# EAGLE schematic BeeBeeAte-BotBoard (EAGLE 9.6.2)

## Sheet 1 of 4: Power Supply
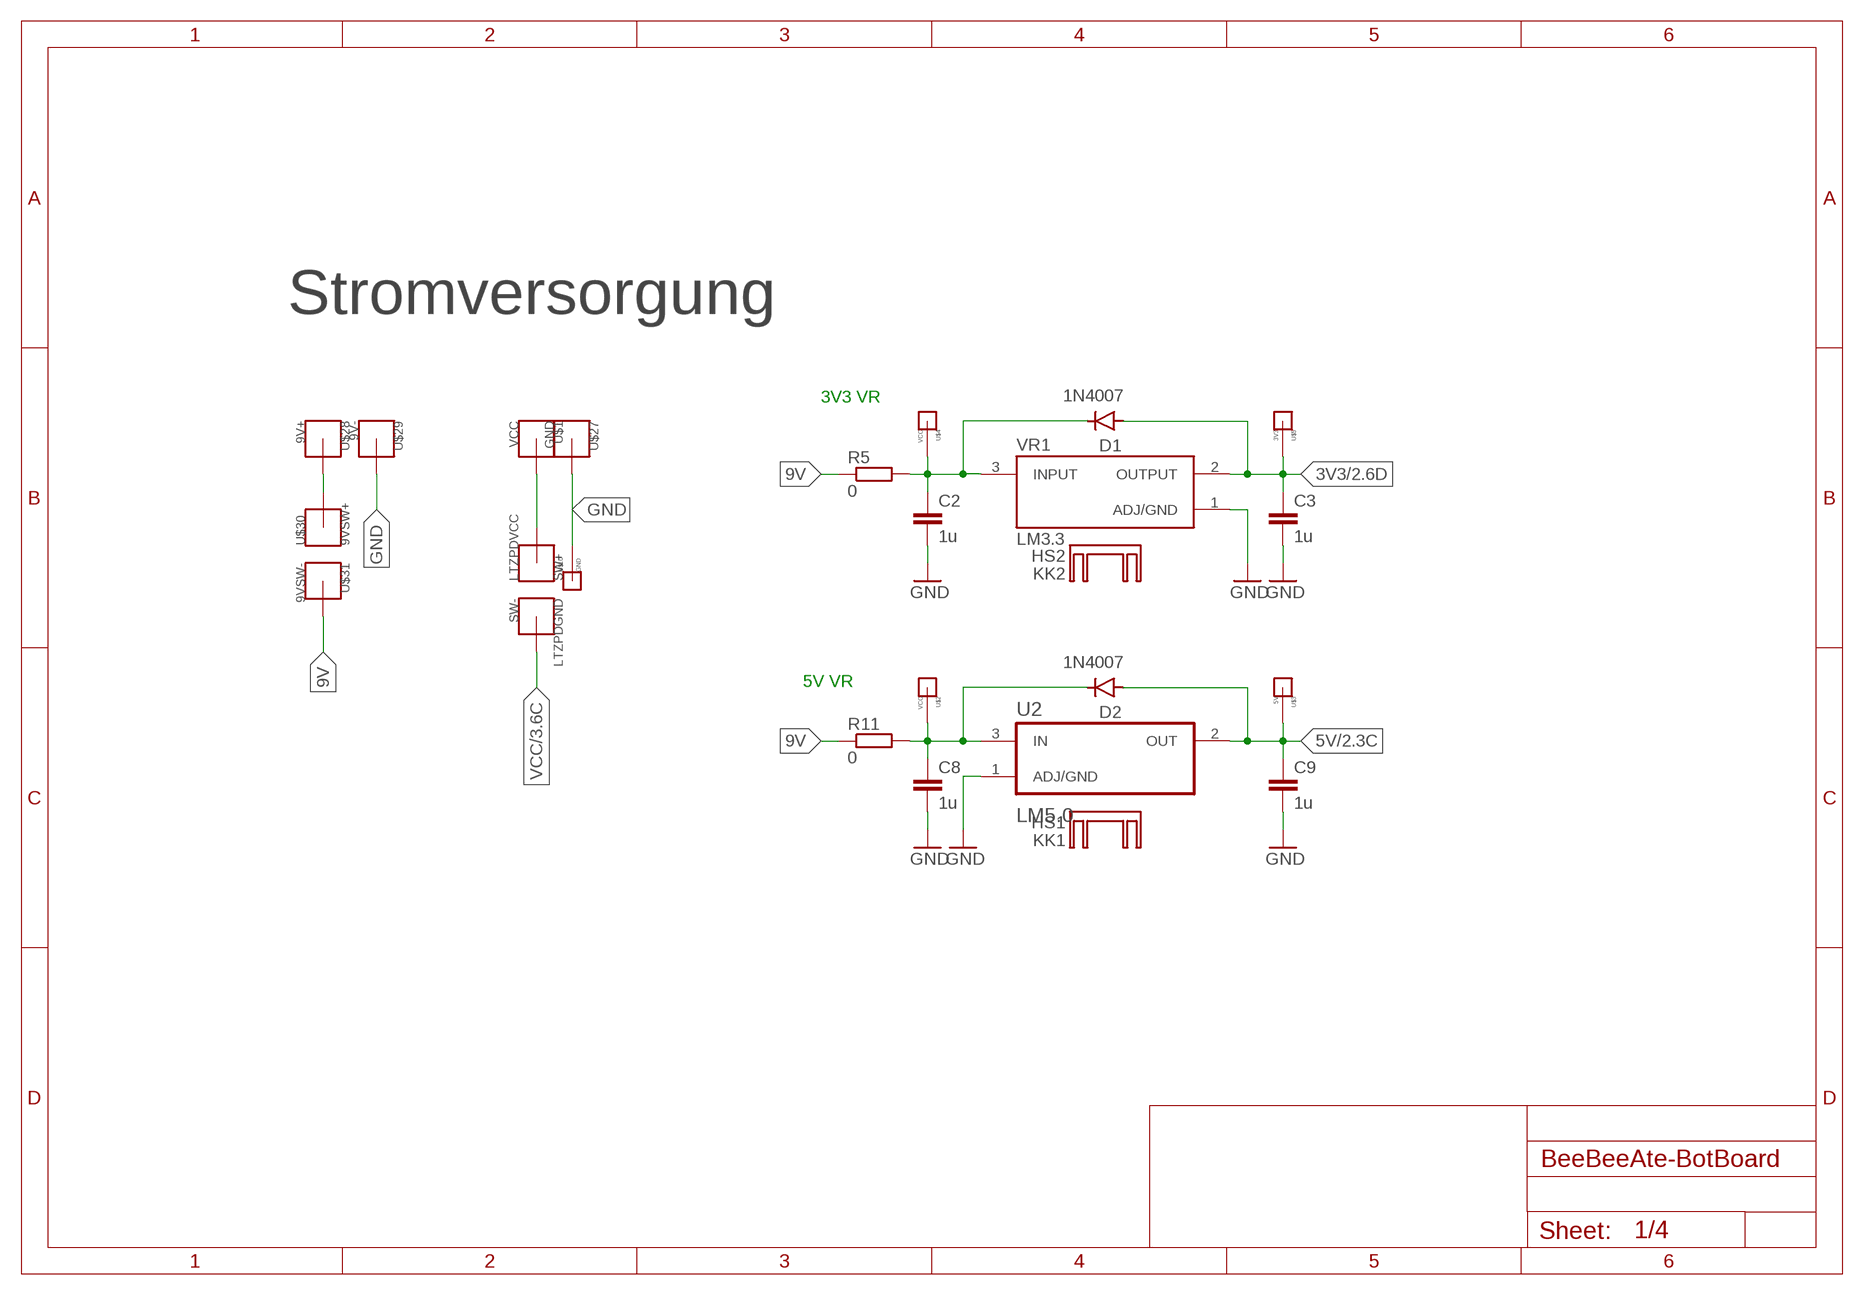
[diagram p0: schematic, sheet 1]

### Parts
C2  1u  C-EUC0805  [C0805]
C3  1u  C-EUC0805  [C0805]
C8  1u  C-EUC0805  [C0805]
C9  1u  C-EUC0805  [C0805]
D1  1N4007  [DO-41]
D2  1N4007  [DO-41]
KK1  HS1  SK95-2M3  [SK95-2M3]
KK2  HS2  SK95-2M3  [SK95-2M3]
LTZPDGND  SW-  LITZENPAD  [LITZENPAD]
LTZPDVCC  SW+  LITZENPAD  [LITZENPAD]
R5  0  R-EU_R0805  [R0805]
R11  0  R-EU_R0805  [R0805]
U2  LM5.0  LM1117T-5.0  [TO254P1054X470X1955-3]
U$1  VCC  LITZENPAD  [LITZENPAD]
U$2  VCC  MESSPAD  [MESSPAD]
U$3  5V  MESSPAD  [MESSPAD]
U$4  VCC  MESSPAD  [MESSPAD]
U$5  3V3  MESSPAD  [MESSPAD]
U$10  GND  MESSPAD  [MESSPAD]
U$27  GND  LITZENPAD  [LITZENPAD]
U$28  9V+  LITZENPAD  [LITZENPAD]
U$29  9V-  LITZENPAD  [LITZENPAD]
U$30  9VSW+  LITZENPAD  [LITZENPAD]
U$31  9VSW-  LITZENPAD  [LITZENPAD]
VR1  LM3.3  LM1117T-3.3/NOPB  [TO254P1054X470X1955-3]

### Nets
3V3: C3.1 D1.A U$5.MSP VR1.2(OUTPUT) ; also sheet 2,3,4
5V: C9.1 D2.A U2.2(OUT) U$3.MSP ; also sheet 2
9V: R5.1 R11.1 U$31.P$1
GND: C2.2 C3.2 C8.2 C9.2 U2.1(ADJ/GND) U$10.MSP U$27.P$1 U$29.P$1 VR1.1(ADJ/GND) ; also sheet 2,3,4
N$4: C2.1 D1.C R5.2 U$4.MSP VR1.3(INPUT)
N$5: LTZPDVCC.P$1 U$1.P$1
N$8: C8.1 D2.C R11.2 U2.3(IN) U$2.MSP
N$15: U$28.P$1 U$30.P$1
VCC: LTZPDGND.P$1 ; also sheet 3

### Notes on the sheet
- Stromversorgung
- 3V3 VR
- 5V VR

## Sheet 2 of 4: ESP32 und USB Modul
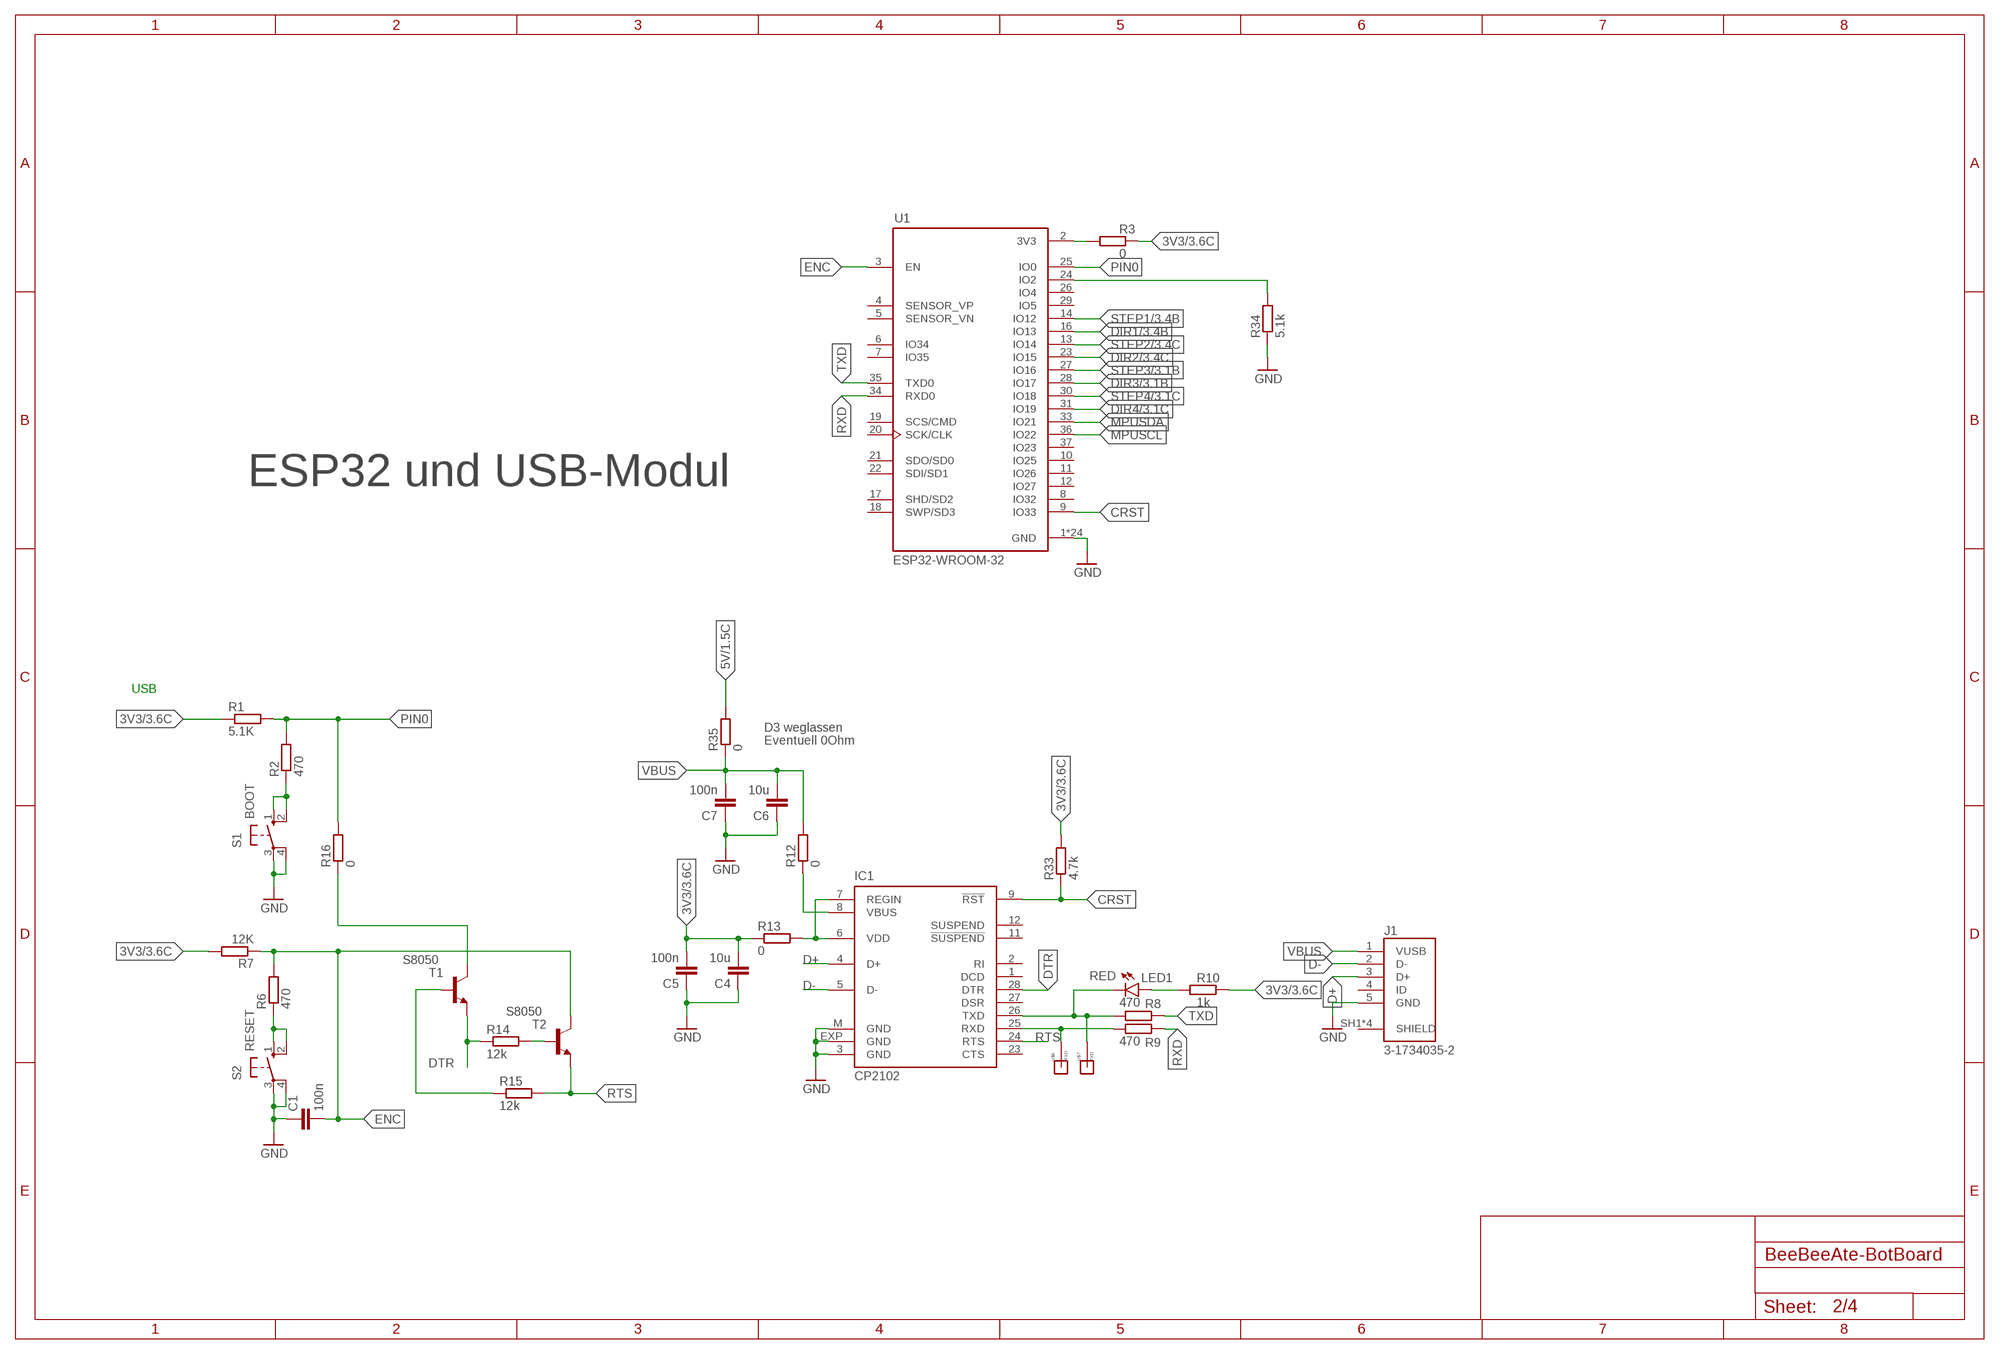
[diagram p1: schematic, sheet 2]

### Parts
C1  100n  C-EUC0805  [C0805]
C4  10u  C-EUC0805  [C0805]
C5  100n  C-EUC0805  [C0805]
C6  10u  C-EUC0805  [C0805]
C7  100n  C-EUC0805  [C0805]
IC1  CP2102  [MLP28]
J1  3-1734035-2  [TE_3-1734035-2]
LED1  RED  LEDCHIP-LED0805  [CHIP-LED0805]
R1  5.1K  R-EU_R0805  [R0805]
R2  470  R-EU_R0805  [R0805]
R3  0  R-EU_R0805  [R0805]
R6  470  R-EU_R0805  [R0805]
R7  12K  R-EU_R0805  [R0805]
R8  470  R-EU_R0805  [R0805]
R9  470  R-EU_R0805  [R0805]
R10  1k  R-EU_R0805  [R0805]
R12  0  R-EU_R0805  [R0805]
R13  0  R-EU_R0805  [R0805]
R14  12k  R-EU_R0805  [R0805]
R15  12k  R-EU_R0805  [R0805]
R16  0  R-EU_R0805  [R0805]
R33  4.7k  R-EU_R0805  [R0805]
R34  5.1k  R-EU_R0805  [R0805]
R35  0  R-EU_R0805  [R0805]
S1  BOOT  10-XX  [B3F-10XX]
S2  RESET  10-XX  [B3F-10XX]
T1  S8050  BC808-NPN-SOT23-BEC  [SOT23-BEC]
T2  S8050  BC808-NPN-SOT23-BEC  [SOT23-BEC]
U1  ESP32-WROOM-32  [MODULE_ESP32-WROOM-32]
U$6  RXD  MESSPAD  [MESSPAD]
U$7  TXD  MESSPAD  [MESSPAD]

### Nets
3V3: C4.2 C5.2 R1.1 R3.2 R7.2 R10.2 R13.1 R33.2 ; also sheet 1,3,4
5V: R35.2 ; also sheet 1
CRST: IC1.9(!RST) R33.1 U1.9(IO33)
D+: IC1.4(D+) J1.3(D+)
D-: IC1.5(D-) J1.2(D-)
DIR1: U1.16(IO13) ; also sheet 3
DIR2: U1.23(IO15) ; also sheet 3
DIR3: U1.28(IO17) ; also sheet 3
DIR4: U1.31(IO19) ; also sheet 3
DTR: IC1.28(DTR) R14.1 T1.E
ENC: C1.2 R6.2 R7.1 T2.C U1.3(EN)
GND: C1.1 C4.1 C5.1 C6.1 C7.1 IC1.3(GND) IC1.EXP(GND) IC1.M(GND) J1.5(GND) R34.1 S1.3(P) S1.4(P1) S2.3(P) S2.4(P1) U1.1(GND) U1.15(GND) U1.38(GND) U1.39_1(GND) U1.39_2(GND) U1.39_3(GND) U1.39_4(GND) U1.39_5(GND) U1.39_6(GND) U1.39_7(GND) U1.39_8(GND) U1.39_9(GND) U1.39_10(GND) U1.39_11(GND) U1.39_12(GND) U1.39_13(GND) U1.39_14(GND) U1.39_15(GND) U1.39_16(GND) U1.39_17(GND) U1.39_18(GND) U1.39_19(GND) U1.39_20(GND) U1.39_21(GND) ; also sheet 1,3,4
MPUSCL: U1.36(IO22) ; also sheet 4
MPUSDA: U1.33(IO21) ; also sheet 4
N$1: R2.1 S1.1(S) S1.2(S1)
N$2: R6.1 S2.1(S) S2.2(S1)
N$6: IC1.25(RXD) R9.1 U$6.MSP
N$7: LED1.A R10.1
N$9: IC1.26(TXD) LED1.C R8.1 U$7.MSP
N$10: IC1.6(VDD) IC1.7(REGIN) R13.2
N$11: IC1.8(VBUS) R12.1
N$12: R14.2 T2.B
N$14: R15.1 T1.B
N$25: R34.2 U1.24(IO2)
N$30: R3.1 U1.2(3V3)
PIN0: R1.2 R2.2 R16.2 U1.25(IO0)
PIN1: R16.1 T1.C
RTS: IC1.24(RTS) R15.2 T2.E
RXD: R9.2 U1.34(RXD0)
STEP1: U1.14(IO12) ; also sheet 3
STEP2: U1.13(IO14) ; also sheet 3
STEP3: U1.27(IO16) ; also sheet 3
STEP4: U1.30(IO18) ; also sheet 3
TXD: R8.2 U1.35(TXD0)
VBUS: C6.2 C7.2 J1.1(VUSB) R12.2 R35.1
Unconnected: IC1.1(DCD) IC1.2(RI) IC1.11(!SUSPEND) IC1.12(SUSPEND) IC1.23(CTS) IC1.27(DSR) J1.4(ID) J1.SH1(SHIELD) J1.SH2(SHIELD) J1.SH3(SHIELD) J1.SH4(SHIELD) U1.4(SENSOR_VP) U1.5(SENSOR_VN) U1.6(IO34) U1.7(IO35) U1.8(IO32) U1.10(IO25) U1.11(IO26) U1.12(IO27) U1.17(SHD/SD2) U1.18(SWP/SD3) U1.19(SCS/CMD) U1.20(SCK/CLK) U1.21(SDO/SD0) U1.22(SDI/SD1) U1.26(IO4) U1.29(IO5) U1.37(IO23)

### Notes on the sheet
- ESP32 und USB-Modul
- USB
- D3 weglassen
- Eventuell 0Ohm

## Sheet 3 of 4: Treiber für Motoren
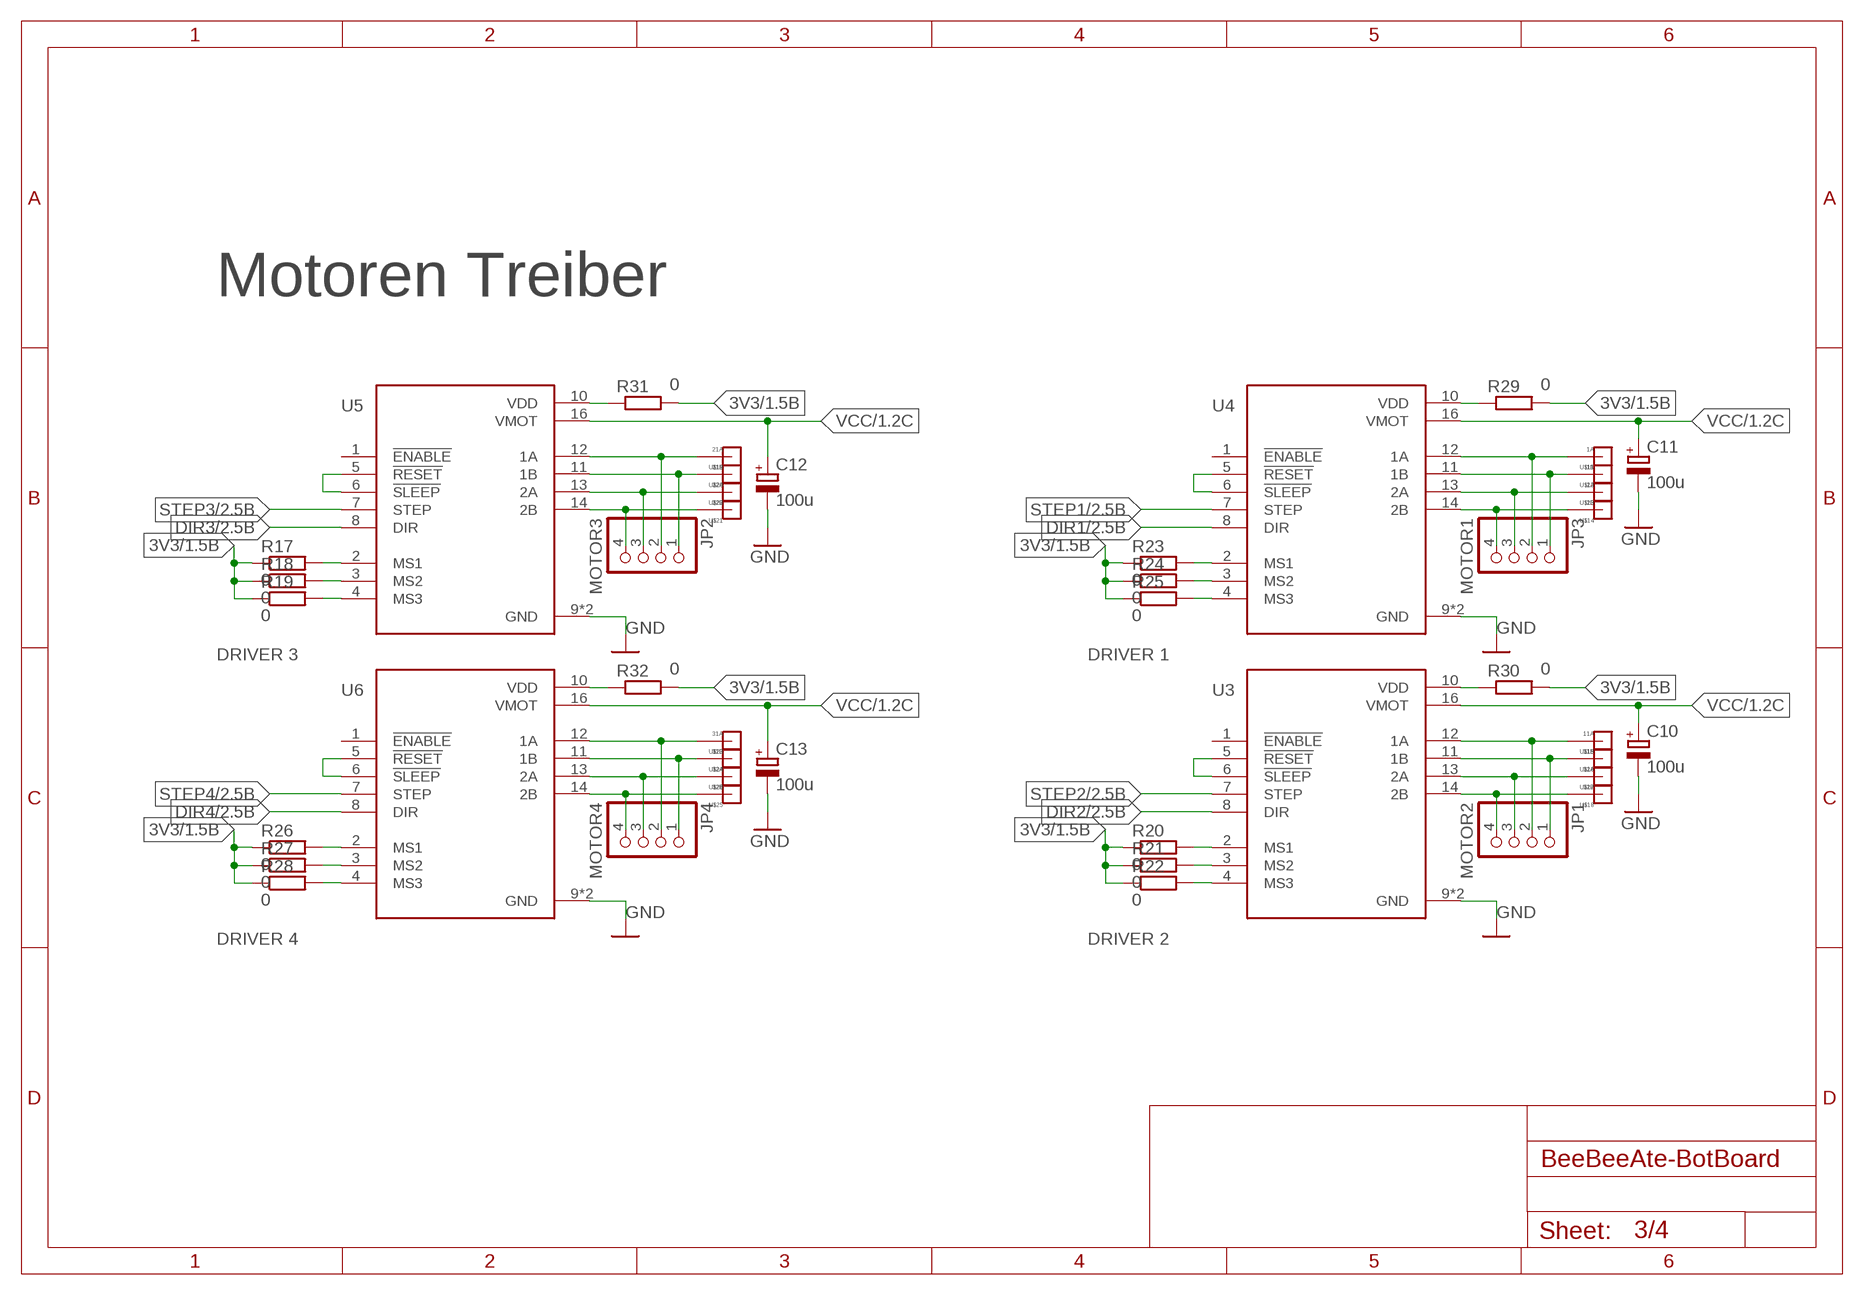
[diagram p2: schematic, sheet 3]

### Parts
C10  100u  CPOL-EU153CLV-0605  [153CLV-0605]
C11  100u  CPOL-EU153CLV-0605  [153CLV-0605]
C12  100u  CPOL-EU153CLV-0605  [153CLV-0605]
C13  100u  CPOL-EU153CLV-0605  [153CLV-0605]
JP1  MOTOR2  PINHD-1X4  [1X04]
JP2  MOTOR3  PINHD-1X4  [1X04]
JP3  MOTOR1  PINHD-1X4  [1X04]
JP4  MOTOR4  PINHD-1X4  [1X04]
R17  0  R-EU_R0805  [R0805]
R18  0  R-EU_R0805  [R0805]
R19  0  R-EU_R0805  [R0805]
R20  0  R-EU_R0805  [R0805]
R21  0  R-EU_R0805  [R0805]
R22  0  R-EU_R0805  [R0805]
R23  0  R-EU_R0805  [R0805]
R24  0  R-EU_R0805  [R0805]
R25  0  R-EU_R0805  [R0805]
R26  0  R-EU_R0805  [R0805]
R27  0  R-EU_R0805  [R0805]
R28  0  R-EU_R0805  [R0805]
R29  0  R-EU_R0805  [R0805]
R30  0  R-EU_R0805  [R0805]
R31  0  R-EU_R0805  [R0805]
R32  0  R-EU_R0805  [R0805]
U3  DRIVER 2  A4988_STEPPER_MOTOR_DRIVER_CARRIER  [MODULE_A4988_STEPPER_MOTOR_DRIVER_CARRIER]
U4  DRIVER 1  A4988_STEPPER_MOTOR_DRIVER_CARRIER  [MODULE_A4988_STEPPER_MOTOR_DRIVER_CARRIER]
U5  DRIVER 3  A4988_STEPPER_MOTOR_DRIVER_CARRIER  [MODULE_A4988_STEPPER_MOTOR_DRIVER_CARRIER]
U6  DRIVER 4  A4988_STEPPER_MOTOR_DRIVER_CARRIER  [MODULE_A4988_STEPPER_MOTOR_DRIVER_CARRIER]
U$11  1A  MESSPAD  [MESSPAD]
U$12  1B  MESSPAD  [MESSPAD]
U$13  2A  MESSPAD  [MESSPAD]
U$14  2B  MESSPAD  [MESSPAD]
U$15  11A  MESSPAD  [MESSPAD]
U$16  11B  MESSPAD  [MESSPAD]
U$17  12A  MESSPAD  [MESSPAD]
U$18  12B  MESSPAD  [MESSPAD]
U$19  21A  MESSPAD  [MESSPAD]
U$20  21B  MESSPAD  [MESSPAD]
U$21  22B  MESSPAD  [MESSPAD]
U$22  22A  MESSPAD  [MESSPAD]
U$23  31A  MESSPAD  [MESSPAD]
U$24  31B  MESSPAD  [MESSPAD]
U$25  32B  MESSPAD  [MESSPAD]
U$26  32A  MESSPAD  [MESSPAD]

### Nets
3V3: R17.1 R18.1 R19.1 R20.1 R21.1 R22.1 R23.1 R24.1 R25.1 R26.1 R27.1 R28.1 R29.2 R30.2 R31.2 R32.2 ; also sheet 1,2,4
DIR1: U4.8(DIR) ; also sheet 2
DIR2: U3.8(DIR) ; also sheet 2
DIR3: U5.8(DIR) ; also sheet 2
DIR4: U6.8(DIR) ; also sheet 2
GND: C10.- C11.- C12.- C13.- U3.9(GND) U3.15(GND) U4.9(GND) U4.15(GND) U5.9(GND) U5.15(GND) U6.9(GND) U6.15(GND) ; also sheet 1,2,4
N$13: R30.1 U3.10(VDD)
N$16: JP1.2 U3.12(1A) U$15.MSP
N$17: JP1.1 U3.11(1B) U$16.MSP
N$18: JP1.3 U3.13(2A) U$17.MSP
N$19: JP1.4 U3.14(2B) U$18.MSP
N$20: R20.2 U3.2(MS1)
N$21: R21.2 U3.3(MS2)
N$22: R22.2 U3.4(MS3)
N$23: U3.5(!RESET) U3.6(!SLEEP)
N$24: R29.1 U4.10(VDD)
N$26: JP2.2 U5.12(1A) U$19.MSP
N$27: JP2.1 U5.11(1B) U$20.MSP
N$28: JP2.3 U5.13(2A) U$22.MSP
N$29: JP2.4 U5.14(2B) U$21.MSP
N$32: JP3.2 U4.12(1A) U$11.MSP
N$33: JP3.1 U4.11(1B) U$12.MSP
N$34: JP3.3 U4.13(2A) U$13.MSP
N$35: R17.2 U5.2(MS1)
N$36: R18.2 U5.3(MS2)
N$37: R19.2 U5.4(MS3)
N$38: U5.5(!RESET) U5.6(!SLEEP)
N$39: R31.1 U5.10(VDD)
N$40: R32.1 U6.10(VDD)
N$41: JP3.4 U4.14(2B) U$14.MSP
N$42: R23.2 U4.2(MS1)
N$43: R24.2 U4.3(MS2)
N$44: R25.2 U4.4(MS3)
N$45: U4.5(!RESET) U4.6(!SLEEP)
N$49: JP4.2 U6.12(1A) U$23.MSP
N$50: JP4.1 U6.11(1B) U$24.MSP
N$51: JP4.3 U6.13(2A) U$26.MSP
N$52: JP4.4 U6.14(2B) U$25.MSP
N$53: R26.2 U6.2(MS1)
N$54: R27.2 U6.3(MS2)
N$55: R28.2 U6.4(MS3)
N$56: U6.5(!RESET) U6.6(!SLEEP)
STEP1: U4.7(STEP) ; also sheet 2
STEP2: U3.7(STEP) ; also sheet 2
STEP3: U5.7(STEP) ; also sheet 2
STEP4: U6.7(STEP) ; also sheet 2
VCC: C10.+ C11.+ C12.+ C13.+ U3.16(VMOT) U4.16(VMOT) U5.16(VMOT) U6.16(VMOT) ; also sheet 1
Unconnected: U3.1(!ENABLE) U4.1(!ENABLE) U5.1(!ENABLE) U6.1(!ENABLE)

### Notes on the sheet
- Motoren Treiber

## Sheet 4 of 4: MPU6050
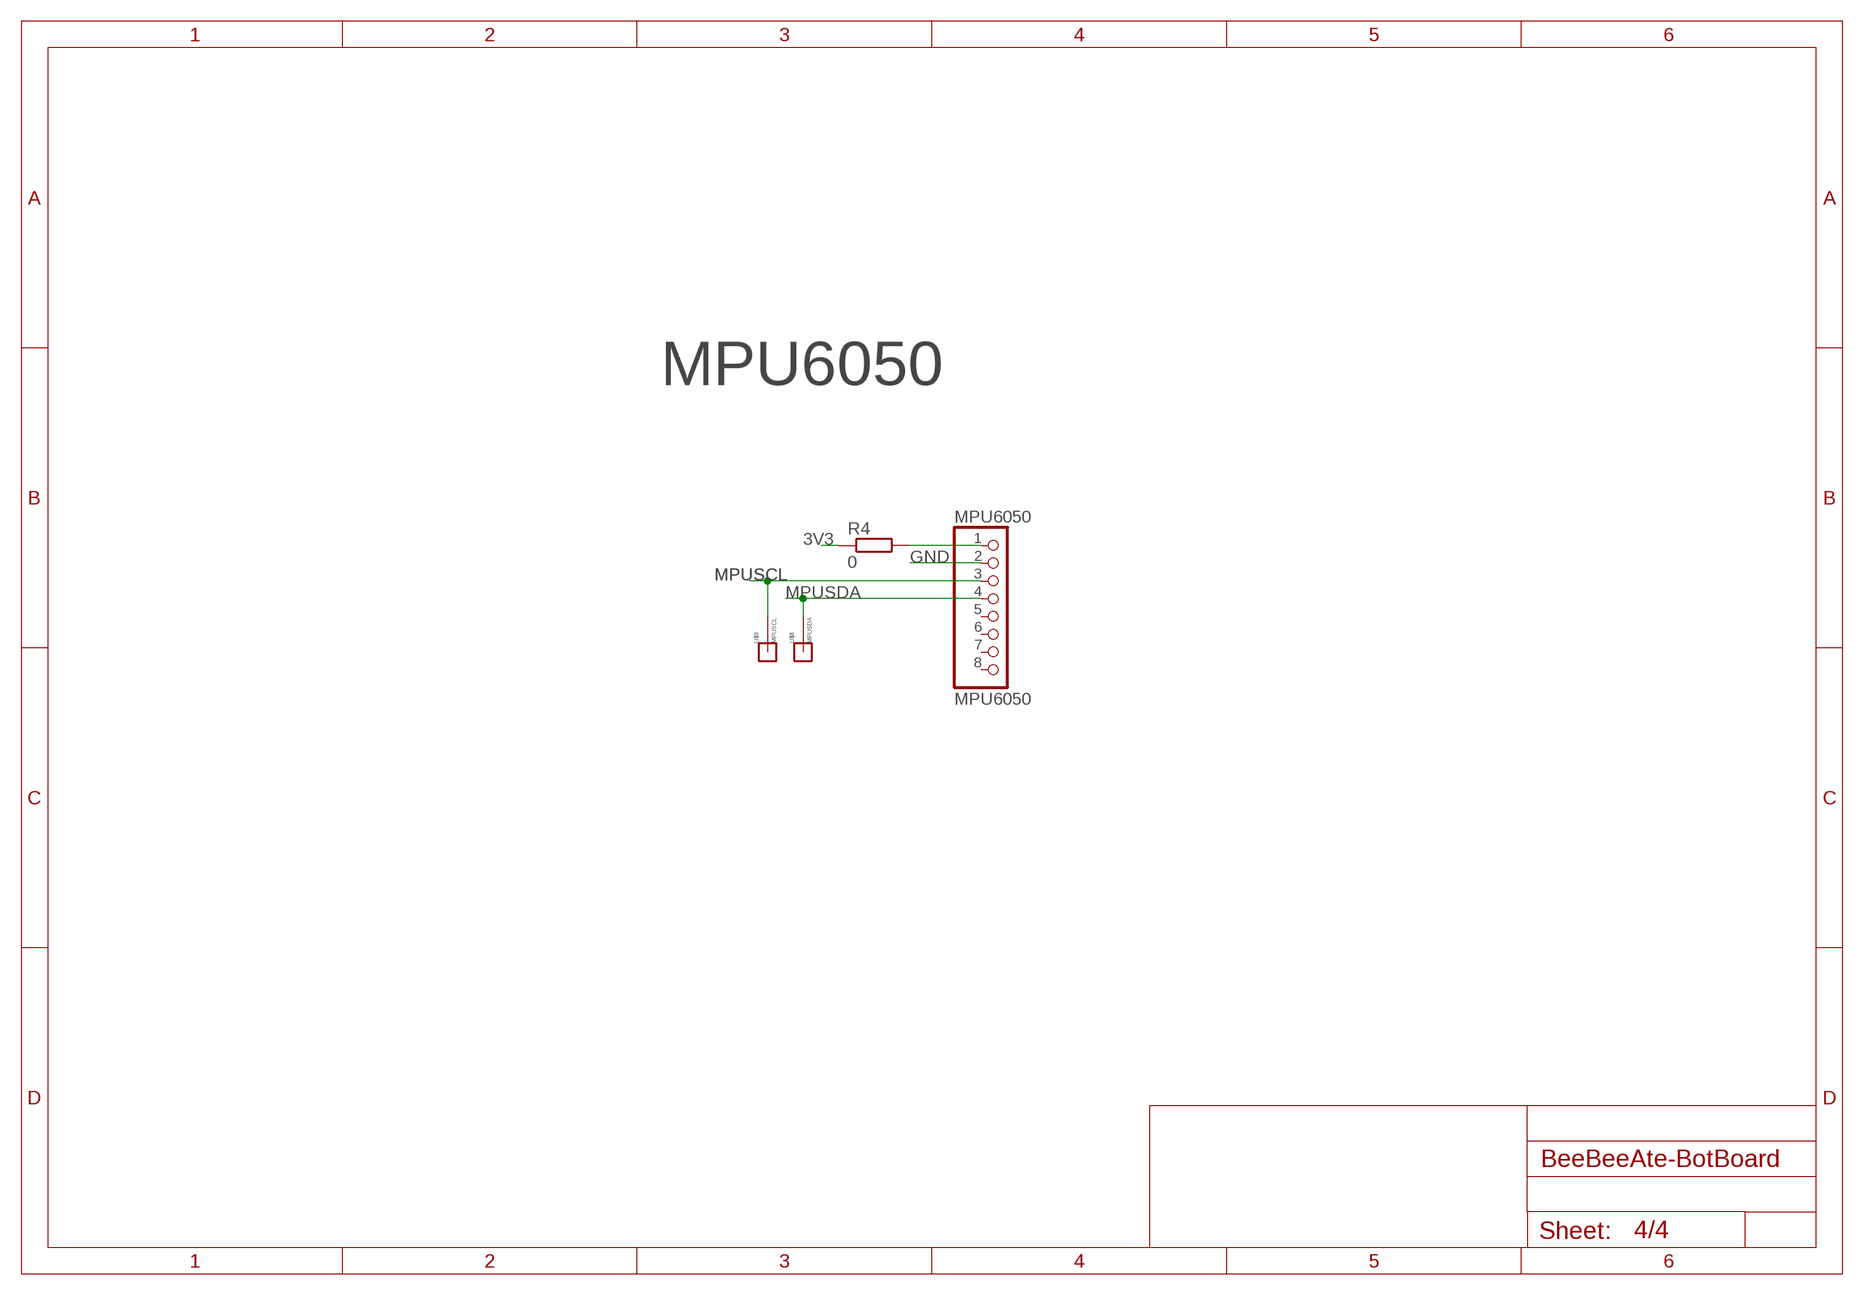
[diagram p3: schematic, sheet 4]

### Parts
MPU6050  MPU6050  PINHD-1X8  [1X08]
R4  0  R-EU_R0805  [R0805]
U$8  MPUSDA  MESSPAD  [MESSPAD]
U$9  MPUSCL  MESSPAD  [MESSPAD]

### Nets
3V3: R4.1 ; also sheet 1,2,3
GND: MPU6050.2 ; also sheet 1,2,3
MPUSCL: MPU6050.3 U$9.MSP ; also sheet 2
MPUSDA: MPU6050.4 U$8.MSP ; also sheet 2
N$3: MPU6050.1 R4.2
Unconnected: MPU6050.5 MPU6050.6 MPU6050.7 MPU6050.8

### Notes on the sheet
- MPU6050

## Library data of the parts
C1-C9 = rcl:C-EU: CAPACITOR, European symbol; SPICEPREFIX: C
C10-C13 = rcl:CPOL-EU: POLARIZED CAPACITOR, European symbol; SPICEPREFIX: C
D1 D2 = Diodes:1N4007: DIODE GEN PURP 1KV 1A DO41 Manufacturer's datasheet <https://www.mccsemi.com/pdf/Products/1N4001-1N4007(DO-41).pdf>; CREATED_BY: PCBLayout.com; DIGIKEY_PART_NUMBER: 1N4007MSCT-ND; MANUFACTURER: Micro Commercial Co; MPN: 1N4007; PACKAGE: DO-41
IC1 = silabs:CP210*: Single-Chip USB to UART Bridge Source: www.silabs.com .. CP2101.pdf / cp2102.pdf; MF: FARNELL; MPN: CP2102-GM; OC_FARNELL: 9282130; OC_NEWARK: 30K5635
J1 = 3-1734035-2:3-1734035-2: USB Connectors MINI USB, R/A, SMT, MATTE TIN, W/O MYLAR Check prices <https://pricing.snapeda.com/parts/3-1734035-2/TE%20Connectivity/view-part?ref=eda>; AVAILABILITY: In Stock; COMMENT: 3-1734035-2; DESCRIPTION: USB Connectors MINI USB, R/A, SMT, MATTE TIN, W/O MYLAR; MF: TE Connectivity; MP: 3-1734035-2; PACKAGE: None; PRICE: None; PURCHASE-URL: https://pricing.snapeda.com/search/part/3-1734035-2/?ref=eda
JP1-JP4 = pinhead:PINHD-1X4: PIN HEADER
KK1 KK2 = heatsink:SK95-2M3: HEATSINK manufacturer Fischer/distributor Buerklin
LED1 = led:LED: LED OSRAM: - CHIPLED LG R971, LG N971, LY N971, LG Q971, LY Q971, LO R971, LY R971 LH N974, LH R974 LS Q976, LO Q976, LY Q976 LO Q996 - Hyper CHIPLED LW Q18S LB Q993, LB Q99A, LB R99A - SideLED LS A670, LO A670, LY A670, LG A670, LP A670 LB A673, LV A673, LT A673, LW A673 LH A674 LY A675 LS A676, LA A676, LO A676, LY A676, LW A676 LS A679, LY A679, LG A679 - Hyper Micro SIDELED® LS Y876, LA Y876, LO Y876, LY Y876 LT Y87S - SmartLED LW L88C, LW L88S LB L89C, LB L89S, LG L890 LS L89K, LO L89K, LY L89K LS L896, LA L896, LO L896, LY L896 - TOPLED LS T670, LO T670, LY T670, LG T670, LP T670 LSG T670, LSP T670, LSY T670, LOP T670, LYG T670 LG T671, LOG T671, LSG T671 LB T673, LV T673, LT T673, LW T673 LH T674 LS T676, LA T676, LO T676, LY T676, LB T676, LH T676, LSB T676, LW T676 LB T67C, LV T67C, LT T67C, LS T67K, LO T67K, LY T67K, LW E67C LS E67B, LA E67B, LO E67B, LY E67B, LB E67C, LV E67C, LT E67C LW T67C LS T679, LY T679, LG T679 LS T770, LO T770, LY T770, LG T770, LP T770 LB T773, LV T773, LT T773, LW T773 LH T774 LS E675, LA E675, LY E675, LS T675 LS T776, LA T776, LO T776, LY T776, LB T776 LHGB T686 LT T68C, LB T68C - Hyper Mini TOPLED® LB M676 - Mini TOPLED Santana® LG M470 LS M47K, LO M47K, LY M47K Source: http://www.osram.convergy.de LUXEON: - LUMILED® LXK2-PW12-R00, LXK2-PW12-S00, LXK2-PW14-U00, LXK2-PW14-V00 LXK2-PM12-R00, LXK2-PM12-S00, LXK2-PM14-U00 LXK2-PE12-Q00, LXK2-PE12-R00, LXK2-PE12-S00, LXK2-PE14-T00, LXK2-PE14-U00 LXK2-PB12-K00, LXK2-PB12-L00, LXK2-PB12-M00, LXK2-PB14-N00, LXK2-PB14-P00, LXK2-PB14-Q00 LXK2-PR12-L00, LXK2-PR12-M00, LXK2-PR14-Q00, LXK2-PR14-R00 LXK2-PD12-Q00, LXK2-PD12-R00, LXK2-PD12-S00 LXK2-PH12-R00, LXK2-PH12-S00 LXK2-PL12-P00, LXK2-PL12-Q00, LXK2-PL12-R00 Source: www.luxeon.com KINGBRIGHT: KA-3528ASYC Source: www.kingbright.com
LTZPDGND LTZPDVCC U$1 U$27-U$31 = 03lanfra-PADS:LITZENPAD
MPU6050 = pinhead:PINHD-1X8: PIN HEADER
R1-R35 = rcl:R-EU_: RESISTOR, European symbol; SPICEPREFIX: R
S1 S2 = switch-omron:10-XX: OMRON SWITCH; MPN: B3F-1000; OC_FARNELL: 176432; OC_NEWARK: 36M3542
T1 T2 = transistor:*-NPN-: NPN Transistror BF959 corrected 2008.03.06
U1 = ESP32-WROOM-32:ESP32-WROOM-32: Bluetooth, WiFi Transceiver Module 2.4GHz ~ 2.5GHz Surface Mount Check prices <https://pricing.snapeda.com/parts/ESP32-WROOM-32/Espressif%20Systems/view-part?ref=eda>; AVAILABILITY: In Stock; DESCRIPTION: Bluetooth, WiFi 802.11b/g/n, Bluetooth v4.2 +EDR, Class 1, 2 and 3 Transceiver Module 2.4GHz ~ 2.5GHz Antenna Not Included, U.FL Surface Mount; MF: Espressif Systems; MP: ESP32-WROOM-32; PACKAGE: Module Espressif Systems; PRICE: None; PURCHASE-URL: https://pricing.snapeda.com/search/part/ESP32-WROOM-32/?ref=eda
U2 = LM1117T-5.0:LM1117T-5.0: Check prices <https://pricing.snapeda.com/parts/LM1117T-5.0/NOPB/Texas%20Instruments/view-part?ref=eda>; AVAILABILITY: In Stock; DESCRIPTION: 800-mA 15-V linear voltage regulator 3-TO-220 0 to 125; MF: Texas Instruments; MP: LM1117T-5.0/NOPB; PACKAGE: TO-220-3 Texas Instruments; PRICE: None; PURCHASE-URL: https://pricing.snapeda.com/search/part/LM1117T-5.0/NOPB/?ref=eda
U3-U6 = A4988_STEPPER_MOTOR_DRIVER_CARRIER:A4988_STEPPER_MOTOR_DRIVER_CARRIER: Stepper motor controler; IC: A4988; 1A; Uin mot: 8÷35V Check prices <https://pricing.snapeda.com/parts/A4988%20STEPPER%20MOTOR%20DRIVER%20CARRIER/Pololu/view-part?ref=eda>; AVAILABILITY: Not in stock; DESCRIPTION: Stepper Motor Driver; MF: Pololu; MP: A4988 STEPPER MOTOR DRIVER CARRIER; PACKAGE: None; PRICE: None
U$2-U$26 = 03lanfra-PADS:MESSPAD
VR1 = LM1117T-3.3:LM1117T-3.3/NOPB: Check prices <https://pricing.snapeda.com/parts/LM1117T-3.3/NOPB/Texas%20Instruments/view-part?ref=eda>; AVAILABILITY: In Stock; DESCRIPTION: 800-mA 15-V linear voltage regulator 3-TO-220 0 to 125; MF: Texas Instruments; MP: LM1117T-3.3/NOPB; PACKAGE: TO-220-3 Texas Instruments; PRICE: None; PURCHASE-URL: https://pricing.snapeda.com/search/part/LM1117T-3.3/NOPB/?ref=eda